# EAGLE design Power Distribution 24v (EAGLE 7.2.0)
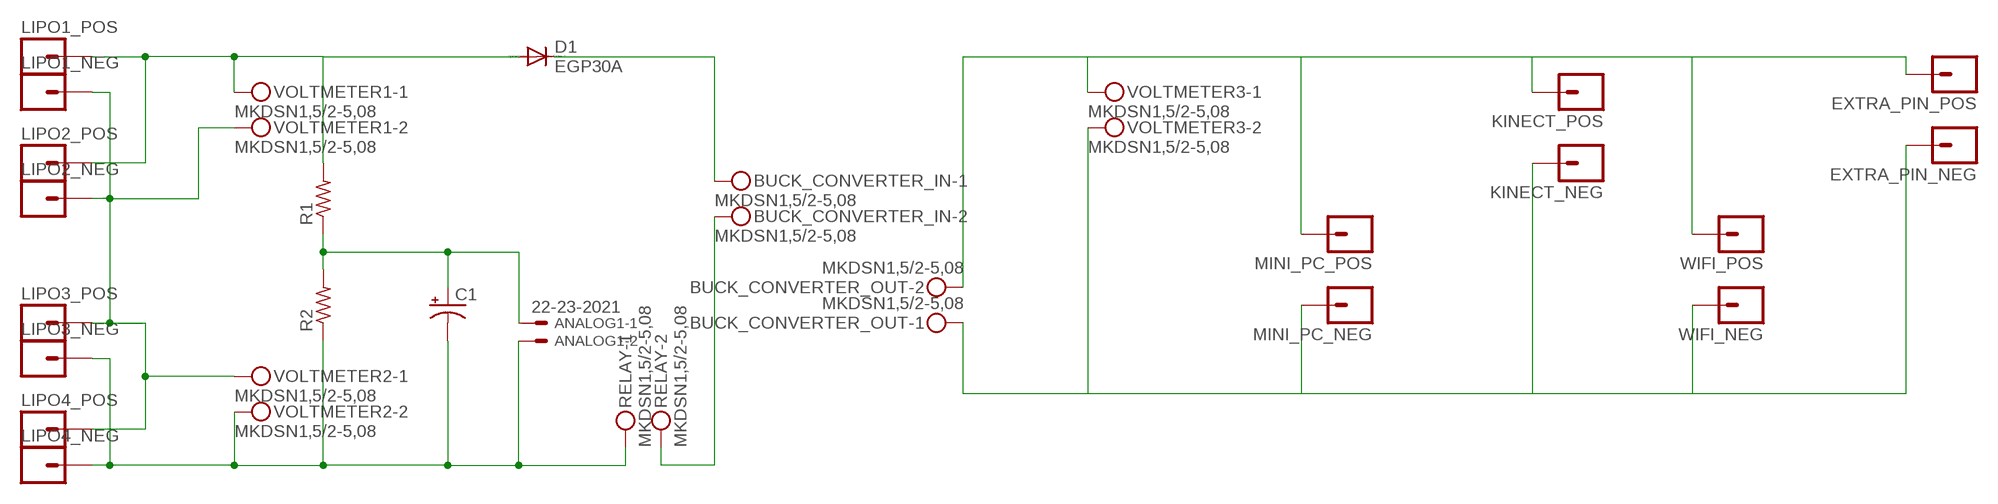
[diagram p0: schematic, sheet 1]

## Parts
ANALOG1  22-23-2021  [22-23-2021]
BUCK_CONVERTER_IN  MKDSN1,5/2-5,08  [MKDSN1,5/2-5,08]
BUCK_CONVERTER_OUT  MKDSN1,5/2-5,08  [MKDSN1,5/2-5,08]
C1  CPOL-USE2-5  [E2-5]
D1  EGP30A  [DO201-15]
EXTRA_PIN_NEG  M01PTH_2MM  [1X01_2MM]
EXTRA_PIN_POS  M01PTH_2MM  [1X01_2MM]
KINECT_NEG  M01PTH_2MM  [1X01_2MM]
KINECT_POS  M01PTH_2MM  [1X01_2MM]
LIPO1_NEG  M01PTH_2MM  [1X01_2MM]
LIPO1_POS  M01PTH_2MM  [1X01_2MM]
LIPO2_NEG  M01PTH_2MM  [1X01_2MM]
LIPO2_POS  M01PTH_2MM  [1X01_2MM]
LIPO3_NEG  M01PTH_2MM  [1X01_2MM]
LIPO3_POS  M01PTH_2MM  [1X01_2MM]
LIPO4_NEG  M01PTH_2MM  [1X01_2MM]
LIPO4_POS  M01PTH_2MM  [1X01_2MM]
MINI_PC_NEG  M01PTH_2MM  [1X01_2MM]
MINI_PC_POS  M01PTH_2MM  [1X01_2MM]
R1  R-US_0207/10  [0207/10]
R2  R-US_0207/10  [0207/10]
RELAY  MKDSN1,5/2-5,08  [MKDSN1,5/2-5,08]
VOLTMETER1  MKDSN1,5/2-5,08  [MKDSN1,5/2-5,08]
VOLTMETER2  MKDSN1,5/2-5,08  [MKDSN1,5/2-5,08]
VOLTMETER3  MKDSN1,5/2-5,08  [MKDSN1,5/2-5,08]
WIFI_NEG  M01PTH_2MM  [1X01_2MM]
WIFI_POS  M01PTH_2MM  [1X01_2MM]

## Nets
N$1: D1.A LIPO1_POS.1 LIPO2_POS.1 R1.2 VOLTMETER1.1
N$2: ANALOG1.1 C1.+ R1.1 R2.2
N$3: LIPO1_NEG.1 LIPO2_NEG.1 LIPO3_POS.1 LIPO4_POS.1 VOLTMETER1.2 VOLTMETER2.1
N$4: BUCK_CONVERTER_IN.1 D1.C
N$5: ANALOG1.2 C1.- LIPO3_NEG.1 LIPO4_NEG.1 R2.1 RELAY.1 VOLTMETER2.2
N$6: BUCK_CONVERTER_IN.2 RELAY.2
N$7: BUCK_CONVERTER_OUT.2 EXTRA_PIN_POS.1 KINECT_POS.1 MINI_PC_POS.1 VOLTMETER3.1 WIFI_POS.1
N$8: BUCK_CONVERTER_OUT.1 EXTRA_PIN_NEG.1 KINECT_NEG.1 MINI_PC_NEG.1 VOLTMETER3.2 WIFI_NEG.1

## Library data of the parts
ANALOG1 = con-molex:22-23-2021: .100" (2.54mm) Center Header - 2 Pin; MF: MOLEX; MPN: 22-23-2021; OC_FARNELL: 1462926; OC_NEWARK: 25C3832
BUCK_CONVERTER_IN BUCK_CONVERTER_OUT RELAY VOLTMETER1-VOLTMETER3 = con-phoenix-508:MKDSN1,5/2-5,08: MKDSN 1,5/ 2-5,08 Printklemme Nennstrom: 13,5 A Nennspannung: 250 V Rastermaß: 5,08 mm Polzahl: 2 Anschlussart: Schraubanschluss Montage: Löten Anschlussrichtung Leiter/Platine: 0 ° Artikelnummer: 1729128 Source: http://eshop.phoenixcontact.com .. 1729128.pdf
C1 = adafruit:CPOL-US: POLARIZED CAPACITOR, American symbol
D1 = diode:EGP30A: DIODE ultra fast-recovery rectifier
EXTRA_PIN_NEG EXTRA_PIN_POS KINECT_NEG KINECT_POS LIPO1_NEG LIPO1_POS LIPO2_NEG LIPO2_POS LIPO3_NEG LIPO3_POS LIPO4_NEG LIPO4_POS MINI_PC_NEG MINI_PC_POS WIFI_NEG WIFI_POS = SparkFun-Connectors:M01: Header 1 Standard 1-pin 0.1" header. Use with straight break away headers (SKU : PRT-00116), right angle break away headers (PRT-00553), swiss pins (PRT-00743), machine pins (PRT-00117), and female headers (PRT-00115).
R1 R2 = adafruit:R-US_: RESISTOR, American symbol

## Board
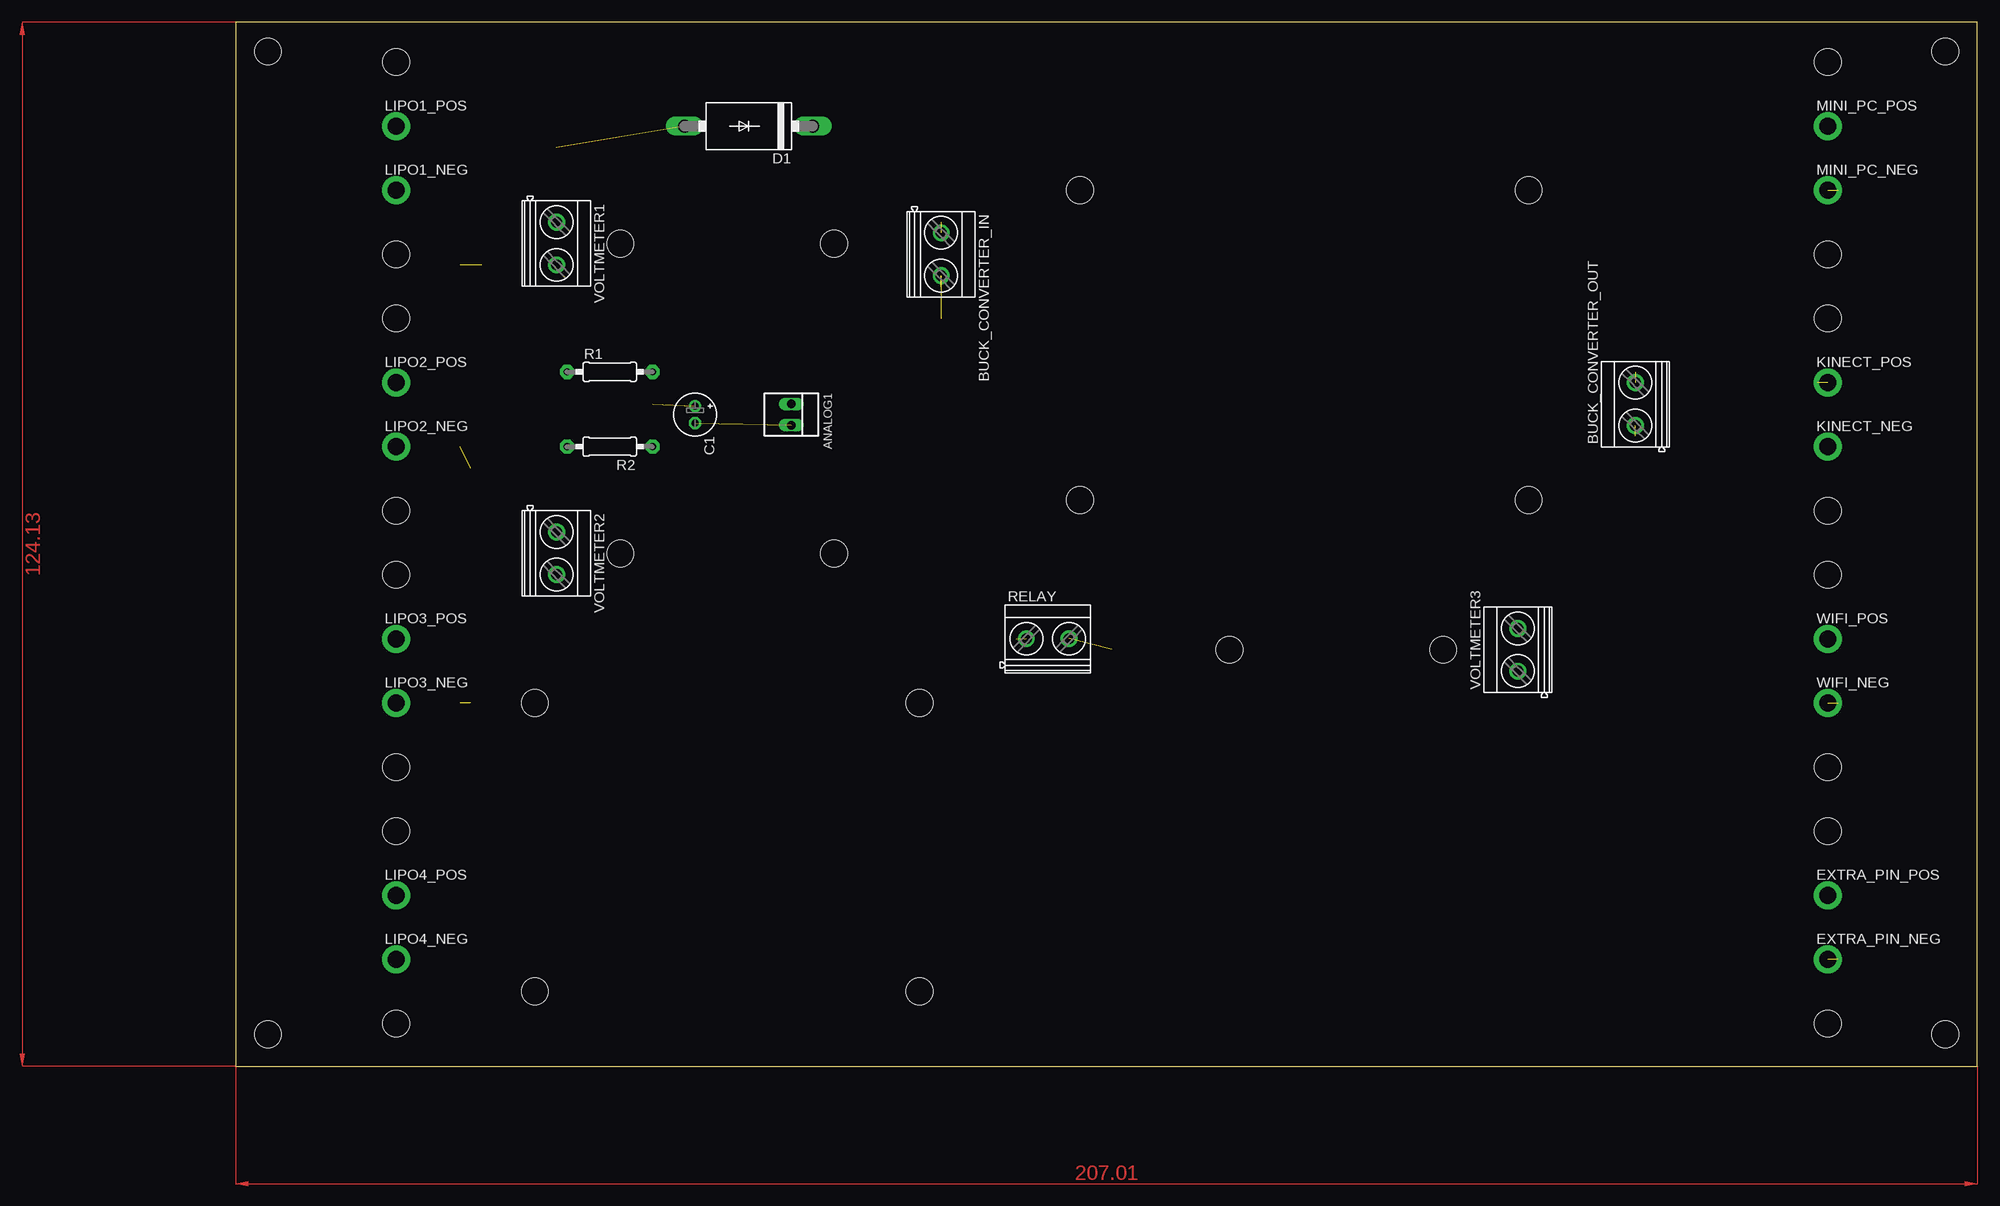
[diagram p1: board, top side]
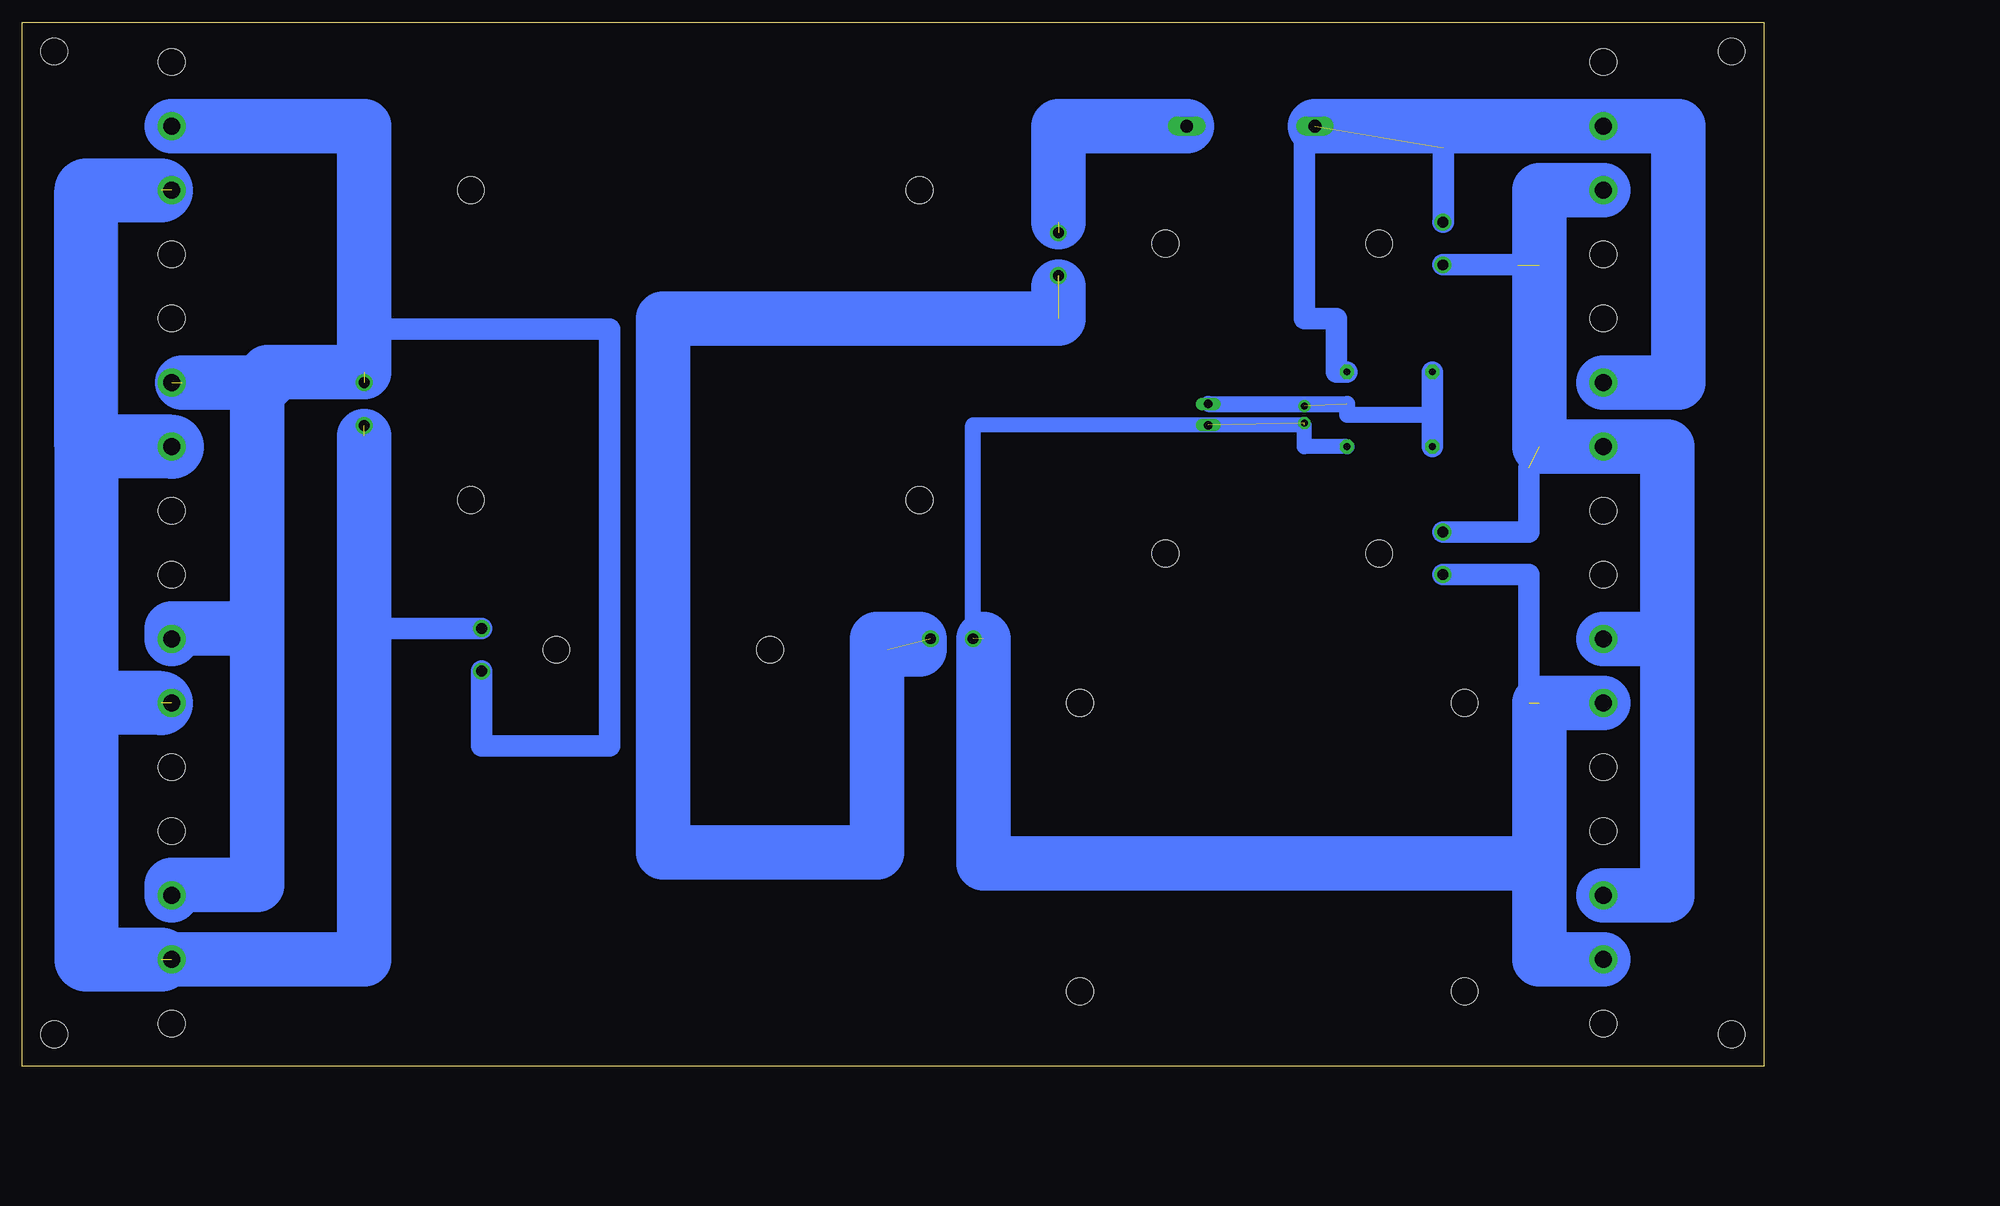
[diagram p2: board, bottom side, seen from below]

Size 206.99 x 124.13 mm. Coordinates in mm from the lower left corner, seen from the top.
Outline: 0,0 206.99,0 206.99,124.13 0,124.13 0,0
Copper layers (1*16): Top 0.035mm / dielectric 1.5mm / Bottom 0.035mm
Design rules "default": minimum track width 10mil, minimum drill 24mil, track to track 8mil, track to pad 8mil, pad to pad 8mil, via to via 8mil, smd to smd 8mil, copper to edge 40mil, drill to drill 8mil, minimum pad ring 10mil, minimum via ring 8mil, stop-mask expansion 4mil, vias tented up to drill 0mil, thermal gap 10mil
Holes 3.2 mm at 19.05,5.08 3.81,3.81 35.56,8.89 19.05,27.94 19.05,35.56 35.56,43.18 19.05,58.42 19.05,66.04 45.72,60.96 19.05,88.9 19.05,88.9 19.05,96.52 19.05,119.38 3.81,120.65 45.72,97.79 71.12,60.96 71.12,97.79 81.28,43.18 81.28,8.89 100.33,67.31 100.33,104.14 118.11,49.53 143.51,49.53 153.67,67.31 153.67,104.14 189.23,5.08 189.23,27.94 189.23,35.56 189.23,58.42 189.23,66.04 189.23,88.9 189.23,96.52 189.23,119.38 203.2,120.65 203.2,3.81

### Footprints (pad centres in the part's own frame; a part is rotated, then mirrored left to right if it is on the bottom)
22-23-2021 = drill 1 long: 1 -1.27,0; 2 1.27,0
MKDSN1,5/2-5,08 = drill 1.3 pad 2: 1 -2.561,0.025; 2 2.519,0.025
E2-5 = drill 0.813 pad 1.422: + -1.016,0 | drill 0.813 pad 1.422 octagon: - 1.016,0
DO201-15 = drill 1.499 long: A 7.62,0; C -7.62,0
1X01_2MM = drill 2 pad 3.302: 1 0,0
0207/10 = drill 0.813 pad 1.676 octagon: 1 -5.08,0; 2 5.08,0

### Placement (x,y rotation side)
ANALOG1  66.04,77.47 270 top
BUCK_CONVERTER_IN  83.82,96.52 270 top
BUCK_CONVERTER_OUT  166.37,78.74 90 top
C1  54.61,77.47 270 top
D1  60.96,111.76 180 top
EXTRA_PIN_NEG  189.23,12.7 0 top
EXTRA_PIN_POS  189.23,20.32 0 top
KINECT_NEG  189.23,73.66 0 top
KINECT_POS  189.23,81.28 0 top
LIPO1_NEG  19.05,104.14 0 top
LIPO1_POS  19.05,111.76 0 top
LIPO2_NEG  19.05,73.66 0 top
LIPO2_POS  19.05,81.28 0 top
LIPO3_NEG  19.05,43.18 0 top
LIPO3_POS  19.05,50.8 0 top
LIPO4_NEG  19.05,12.7 0 top
LIPO4_POS  19.05,20.32 0 top
MINI_PC_NEG  189.23,104.14 0 top
MINI_PC_POS  189.23,111.76 0 top
R1  44.45,82.55 0 top
R2  44.45,73.66 180 top
RELAY  96.52,50.8 0 top
VOLTMETER1  38.1,97.79 270 top
VOLTMETER2  38.1,60.96 270 top
VOLTMETER3  152.4,49.53 90 top
WIFI_NEG  189.23,43.18 0 top
WIFI_POS  189.23,50.8 0 top

### Tracks (layer width: path | path; a pad name or v marks a point on that pad's centre or on a via)
N$1  (1 unrouted)
  Bottom 2.54: VOLTMETER1.1 38.1,100.35 38.1,109.22 | D1.A 54.61,111.76 54.61,88.9 50.8,88.9 50.8,82.55 R1.2
  Bottom 6.452: LIPO1_POS.1 D1.A 10.16,111.76 10.16,81.28 LIPO2_POS.1
N$2  (1 unrouted)
  Bottom 1.93: ANALOG1.1 49.53,78.74 49.53,77.47 39.37,77.47
  Bottom 2.54: R1.1 39.37,77.47 R2.2
N$3  (2 unrouted)
  Bottom 2.54: VOLTMETER1.2 29.21,95.27 29.21,95.25 | VOLTMETER2.1 27.94,63.52 27.94,71.12
  Bottom 6.452: LIPO1_NEG.1 26.67,104.14 26.67,73.66 LIPO2_NEG.1 11.43,73.66 11.43,50.8 | LIPO4_POS.1 11.43,20.32 11.43,50.8 | 11.43,50.8 LIPO3_POS.1
N$4  (1 unrouted)
  Bottom 6.452: D1.C 83.82,111.76 83.82,100.33
N$5  (4 unrouted)
  Bottom 1.778: R2.1 54.61,73.66 54.61,76.2 93.98,76.2
  Bottom 1.93: RELAY.1 93.98,50.83 93.98,76.2
  Bottom 2.54: VOLTMETER2.2 27.94,58.44 27.94,43.18
  Bottom 6.452: 26.67,24.13 26.67,43.18 LIPO3_NEG.1 | LIPO4_NEG.1 26.67,12.7 26.67,24.13 | 26.67,24.13 92.71,24.13 92.71,50.8
N$6  (4 unrouted)
  Bottom 6.452: 104.14,49.53 100.33,49.53 100.33,50.8 105.41,50.8 105.41,25.4 130.81,25.4 130.81,88.9 83.82,88.9 83.82,92.71
N$7  (2 unrouted)
  Bottom 2.54: VOLTMETER3.1 152.4,46.97 152.4,38.1 137.16,38.1 137.16,87.63 166.37,87.63
  Bottom 6.452: MINI_PC_POS.1 166.37,111.76 166.37,87.63 166.37,82.55 177.8,82.55 177.8,81.28 179.07,81.28 | 187.96,81.28 179.07,81.28 | 179.07,81.28 179.07,52.07 | WIFI_POS.1 189.23,52.07 179.07,52.07 | 179.07,52.07 179.07,21.59 189.23,21.59 EXTRA_PIN_POS.1
N$8  (4 unrouted)
  Bottom 2.184: VOLTMETER3.2 165.1,52.05 165.1,52.07
  Bottom 2.54: VOLTMETER3.2 166.37,52.05 166.37,52.07
  Bottom 6.452: EXTRA_PIN_NEG.1 166.37,12.7 166.37,52.07 166.37,74.93
  Bottom 7.62: 199.39,73.66 199.39,104.14 190.5,104.14 | KINECT_NEG.1 199.39,73.66 | 199.39,73.66 199.39,43.18 | 190.5,43.18 199.39,43.18 | 199.39,43.18 199.39,12.7 190.5,12.7
(copper drawn outside any net)
  shapes: Top area x2